# EAGLE schematic pqc-rev1_1 (EAGLE 6.1)
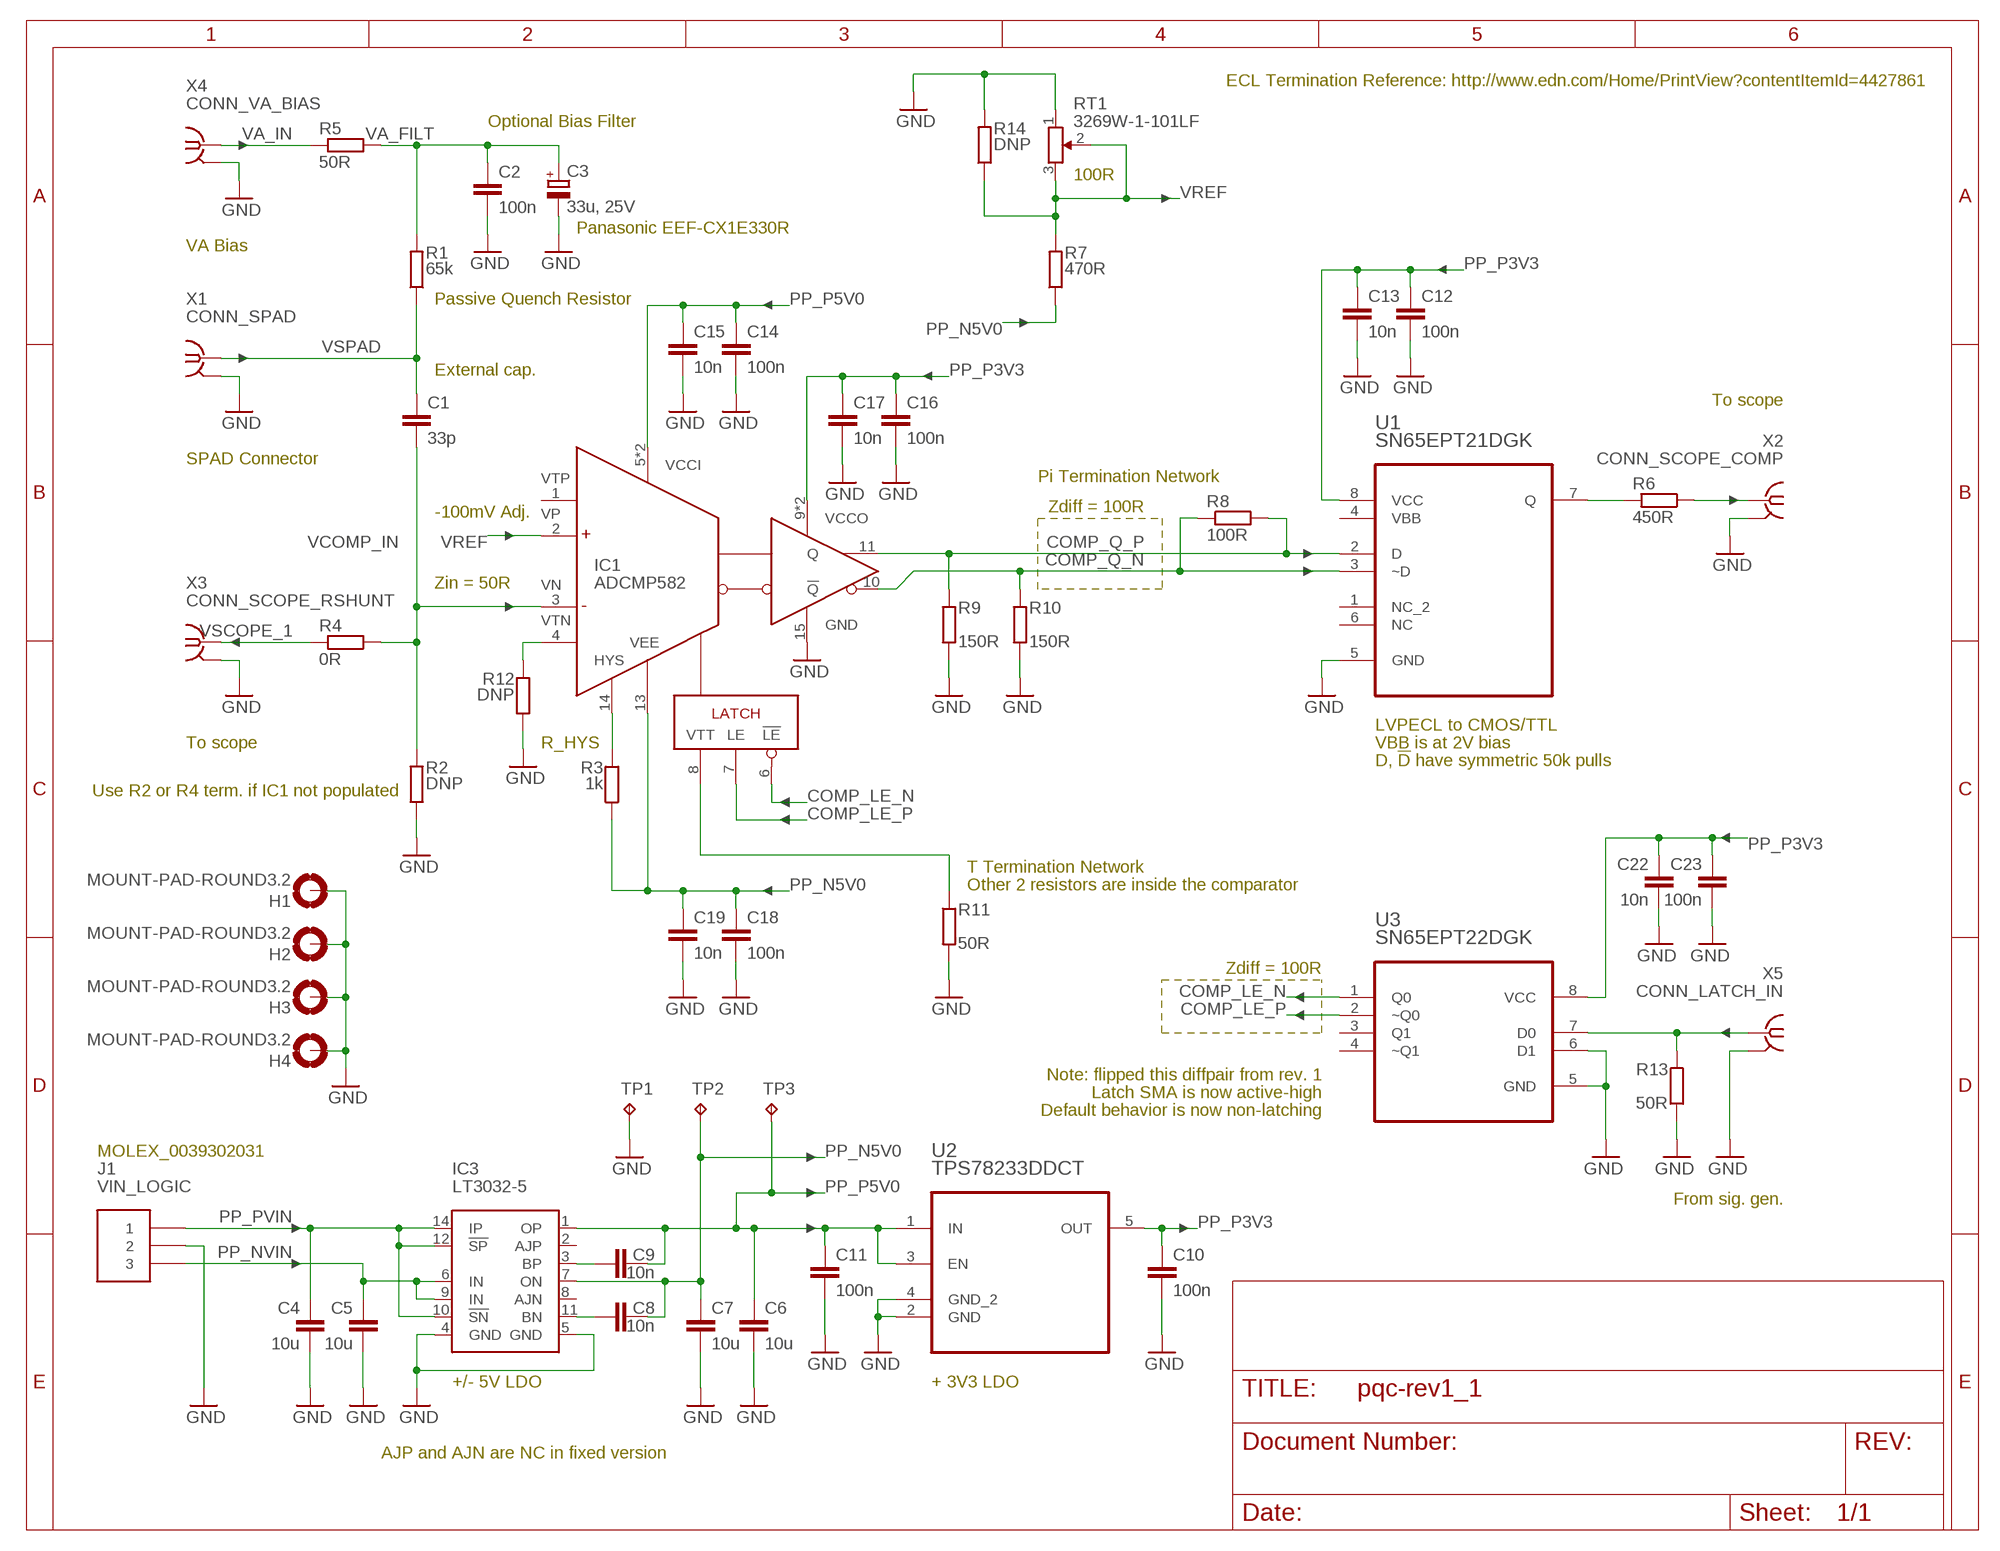
[diagram p0: schematic, sheet 1]

## Parts
C1  33p  C-EUC0805  [C0805]
C2  100n  C-EUC0805  [C0805]
C3  33u, 25V  CPOL-EUCT7343  [CT7343]
C4  10u  C-EUC1206  [C1206]
C5  10u  C-EUC1206  [C1206]
C6  10u  C-EUC1206  [C1206]
C7  10u  C-EUC1206  [C1206]
C8  10n  C-EUC0603  [C0603]
C9  10n  C-EUC0603  [C0603]
C10  100n  C-EUC0603  [C0603]
C11  100n  C-EUC0603  [C0603]
C12  100n  C-EUC0603  [C0603]
C13  10n  C-EUC0603  [C0603]
C14  100n  C-EUC0603  [C0603]
C15  10n  C-EUC0603  [C0603]
C16  100n  C-EUC0603  [C0603]
C17  10n  C-EUC0603  [C0603]
C18  100n  C-EUC0603  [C0603]
C19  10n  C-EUC0603  [C0603]
C22  10n  C-EUC0603  [C0603]
C23  100n  C-EUC0603  [C0603]
H1  MOUNT-PAD-ROUND3.2  [3,2-PAD]
H2  MOUNT-PAD-ROUND3.2  [3,2-PAD]
H3  MOUNT-PAD-ROUND3.2  [3,2-PAD]
H4  MOUNT-PAD-ROUND3.2  [3,2-PAD]
IC1  ADCMP582  [QFN50P300X300X80-16N]
IC3  LT3032-5  LT3032  [DFN14-4X3DE]
J1  VIN_LOGIC  CONN_MOLEX_3PIN_MINI-FIT_JR  [CONN_MOLEX_3PIN_MINI-FIT_JR]
R1  65k  R-EU_R0805  [R0805]
R2  DNP  R-EU_R0603  [R0603]
R3  1k  R-EU_R0805  [R0805]
R4  0R  R-EU_R0603  [R0603]
R5  50R  R-EU_R0805  [R0805]
R6  450R  R-EU_R0603  [R0603]
R7  470R  R-EU_R0805  [R0805]
R8  100R  R-EU_R0603  [R0603]
R9  150R  R-EU_R0603  [R0603]
R10  150R  R-EU_R0603  [R0603]
R11  50R  R-EU_R0603  [R0603]
R12  DNP  R-EU_R0603  [R0603]
R13  50R  R-EU_R0603  [R0603]
R14  DNP  R-EU_R0805  [R0805]
RT1  3269W-1-101LF  BOURNS_3269WX  [3269W]
TP1  TPTP20R  [TP20R]
TP2  TPTP20R  [TP20R]
TP3  TPTP20R  [TP20R]
U1  SN65EPT21DGK  [SOP65P490X110-8N]
U2  TPS78233DDCT  [SOT95P280X110-5N]
U3  SN65EPT22DGK  [SOP65P490X110-8N]
X1  CONN_SPAD  SMA-142-0711-871/876  [J502-ND-142-0711-871/876]
X2  CONN_SCOPE_COMP  SMA-142-0711-871/876  [J502-ND-142-0711-871/876]
X3  CONN_SCOPE_RSHUNT  SMA-142-0711-871/876  [J502-ND-142-0711-871/876]
X4  CONN_VA_BIAS  SMA-142-0711-871/876  [J502-ND-142-0711-871/876]
X5  CONN_LATCH_IN  SMA-142-0711-871/876  [J502-ND-142-0711-871/876]

## Nets
COMP_LE_N [100OHM_DIFF]: IC1.6(!LE) U3.1(Q0)
COMP_LE_P [100OHM_DIFF]: IC1.7(LE) U3.2(~Q0)
COMP_Q_N [100OHM_DIFF]: IC1.10(!Q) R8.1 R10.1 U1.3(~D)
COMP_Q_P [100OHM_DIFF]: IC1.11(Q) R8.2 R9.1 U1.2(D)
GND: C2.2 C3.- C4.2 C5.2 C6.2 C7.2 C10.2 C11.2 C12.2 C13.2 C14.2 C15.2 C16.2 C17.2 C18.2 C19.2 C22.2 C23.2 H1.B3,2(MOUNT) H2.B3,2(MOUNT) H3.B3,2(MOUNT) H4.B3,2(MOUNT) IC1.15(GND) IC3.4(GND) IC3.5(GND) J1.2 R2.1 R9.2 R10.2 R11.2 R12.1 R13.2 R14.2 RT1.1 TP1.TP U1.5(GND) U2.2(GND) U2.4(GND_2) U3.5(GND) U3.6(D1) X1.G@1(GND) X2.G@1(GND) X3.G@1(GND) X4.G@1(GND) X5.G@1(GND)
N$1: R6.2 U1.7(Q)
N$2: R6.1 X2.1
N$3: IC1.4(VTN) R12.2
N$4: IC1.14(HYS) R3.2
N$6: IC1.8(VTT) R11.1
N$8: C9.1 IC3.3(BP)
N$9: C8.1 IC3.11(BN)
N$10: R13.1 U3.7(D0) X5.1
PP_N5V0: C7.1 C8.2 C18.1 C19.1 IC1.13(VEE) IC3.7(ON) R3.1 R7.1 TP2.TP
PP_NVIN: C5.1 IC3.6(IN) IC3.9(IN) J1.3
PP_P3V3: C10.1 C12.1 C13.1 C16.1 C17.1 C22.1 C23.1 IC1.9(VCCO) IC1.12(VCCO) U1.8(VCC) U2.5(OUT) U3.8(VCC)
PP_P5V0: C6.1 C9.2 C11.1 C14.1 C15.1 IC1.5(VCCI) IC1.16(VCCI) IC3.1(OP) TP3.TP U2.1(IN) U2.3(EN)
PP_PVIN: C4.1 IC3.10(!SN) IC3.12(!SP) IC3.14(IP) J1.1
VA_FILT: C2.1 C3.+ R1.2 R5.1
VA_IN: R5.2 X4.1
VCOMP_IN: C1.2 IC1.3(VN) R2.2 R4.1
VREF: IC1.2(VP) R7.2 R14.1 RT1.2 RT1.3
VSCOPE_1: R4.2 X3.1
VSPAD: C1.1 R1.1 X1.1
Unconnected: IC1.1(VTP) IC3.2(AJP) IC3.8(AJN) U1.1(NC_2) U1.6(NC) U3.3(Q1) U3.4(~Q1)

## Notes on the sheet
- ECL Termination Reference: http://www.edn.com/Home/PrintView?contentItemId=4427861
- Optional Bias Filter
- 100R
- Panasonic EEF-CX1E330R
- VA Bias
- Passive Quench Resistor
- External cap.
- To scope
- SPAD Connector
- Pi Termination Network
- Zdiff = 100R
- -100mV Adj.
- Zin = 50R
- LVPECL to CMOS/TTL
- To scope | R_HYS | VBB is at 2V bias
- D, !D! have symmetric 50k pulls
- Use R2 or R4 term. if IC1 not populated
- T Termination Network
- Other 2 resistors are inside the comparator
- Zdiff = 100R
- Note: flipped this diffpair from rev. 1
- Latch SMA is now active-high
- Default behavior is now non-latching
- MOLEX_0039302031
- From sig. gen.
- +/- 5V LDO | + 3V3 LDO
- AJP and AJN are NC in fixed version

## Power pins joined to a net without a drawn wire
GND: X1.G@2(GND) X1.G@3(GND) X1.G@4(GND) X2.G@2(GND) X2.G@3(GND) X2.G@4(GND) X3.G@2(GND) X3.G@3(GND) X3.G@4(GND) X4.G@2(GND) X4.G@3(GND) X4.G@4(GND) X5.G@2(GND) X5.G@3(GND) X5.G@4(GND)
VBB: U1.4(VBB)

## Library data of the parts
C1 C2 C4-C19 C22 C23 = rcl:C-EU: CAPACITOR, European symbol
C3 = rcl:CPOL-EU: POLARIZED CAPACITOR, European symbol
H1-H4 = holes:MOUNT-PAD-ROUND: MOUNTING PAD, round
IC1 = meng:ADCMP582: Ultrafast SiGe Voltage Comparator w/. PECL Outputs http://www.analog.com/media/en/technical-documentation/data-sheets/ADCMP580_581_582.pdf
IC3 = meng:LT3032: LT3032 dual postive/negative LDO linear regulator; VALUE: LT3032
J1 = Kramnik's Library:CONN_MOLEX_3PIN_MINI-FIT_JR; VALUE: MOLEX_0039302031
R1-R14 = rcl:R-EU_: RESISTOR, European symbol
RT1 = meng:BOURNS_3269WX
TP1-TP3 = testpad:TP: Test pad
U1 = Texas Instruments_By_element14_Batch_1:SN65EPT21DGK: 3.3-V Differential PECL/LVDS to TTL Translator; MPN: SN65EPT21DGK; OC_FARNELL: -; OC_NEWARK: 74R6512; PACKAGE: MSOP-8; SUPPLIER: Texas Instruments
U2 = Texas Instruments_By_element14_Batch_1 (2):TPS78233DDCT: Low-Dropout Linear Regulator; MPN: TPS78233DDCT; OC_FARNELL: 1710835; OC_NEWARK: 45P8307; PACKAGE: TSOT-23-5; SUPPLIER: Texas Instruments
U3 = Texas Instruments_By_element14_Batch_1:SN65EPT22DGK: Dual LVTTL/LVCMOS to Differential LVPECL Buffer; MPN: SN65EPT22DGK; OC_FARNELL: -; OC_NEWARK: 45P8158; PACKAGE: MSOP-8; SUPPLIER: Texas Instruments
X1-X5 = con-coax:SMA-: SMA 50 Ohm End Launch Jack Receptacle - Round Contact Johnson Components Source: www.johnsoncomponents.com .. J502-ND.pdf; MF: JOHNSON COMPONENTS; MPN: 142-0711-871; OC_FARNELL: unknown; OC_NEWARK: 01C1639

## Net classes
1 100OHM_DIFF: width 0.254 mm, clearance 0.254 mm